# EAGLE design modulesShield_v1_1 (EAGLE 6.5.0)
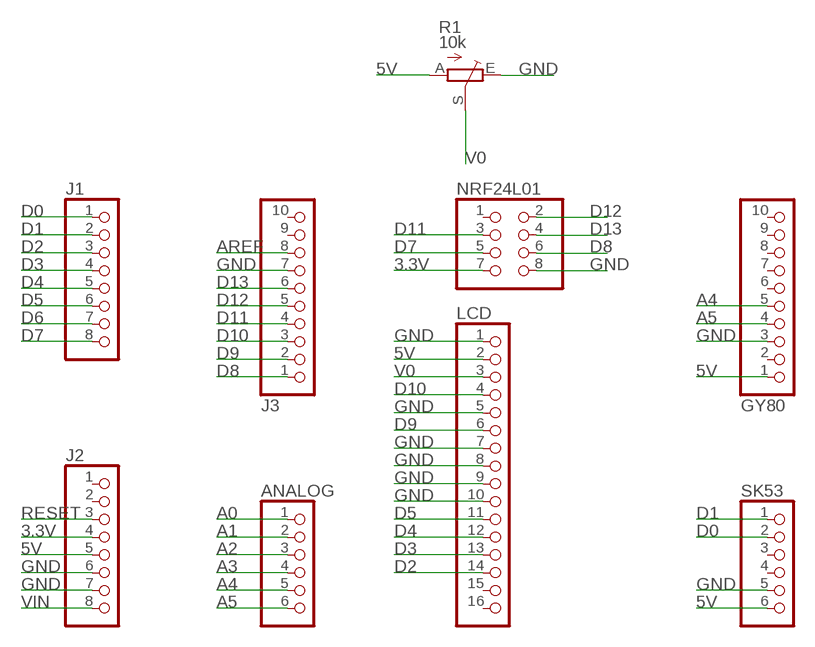
[diagram p0: schematic, sheet 1]

## Parts
ANALOG  PINHD-1X6  [1X06]
GY80  PINHD-1X10TH  [1X10-TH]
J1  PINHD-1X8TH  [1X08-TH]
J2  PINHD-1X8TH  [1X08-TH]
J3  PINHD-1X10TH  [1X10-TH]
LCD  PINHD-1X16  [1X16]
NRF24L01  PINHD-2X4  [2X04]
R1  10k  TRIM_EU-CA6V  [CA6V]
SK53  PINHD-1X6  [1X06]

## Nets
3.3V: J2.4 NRF24L01.7
5V: GY80.1 J2.5 LCD.2 R1.A SK53.6
A0: ANALOG.1
A1: ANALOG.2
A2: ANALOG.3
A3: ANALOG.4
A4: ANALOG.5 GY80.5
A5: ANALOG.6 GY80.4
AREF: J3.8
D0: J1.1 SK53.2
D1: J1.2 SK53.1
D2: J1.3 LCD.14
D3: J1.4 LCD.13
D4: J1.5 LCD.12
D5: J1.6 LCD.11
D6: J1.7
D7: J1.8 NRF24L01.5
D8: J3.1 NRF24L01.6
D9: J3.2 LCD.6
D10: J3.3 LCD.4
D11: J3.4 NRF24L01.3
D12: J3.5 NRF24L01.2
D13: J3.6 NRF24L01.4
GND: GY80.3 J2.6 J2.7 J3.7 LCD.1 LCD.5 LCD.7 LCD.8 LCD.9 LCD.10 NRF24L01.8 R1.E SK53.5
RESET: J2.3
V0: LCD.3 R1.S
VIN: J2.8
Unconnected: GY80.2 GY80.6 GY80.7 GY80.8 GY80.9 GY80.10 J2.1 J2.2 J3.9 J3.10 LCD.15 LCD.16 NRF24L01.1 SK53.3 SK53.4

## Library data of the parts
ANALOG SK53 = pinhead:PINHD-1X6: PIN HEADER
GY80 J3 = SmartPrj:PINHD-1X10: PIN HEADER
J1 J2 = SmartPrj:PINHD-1X8: PIN HEADER
LCD = pinhead:PINHD-1X16: PIN HEADER
NRF24L01 = pinhead:PINHD-2X4: PIN HEADER
R1 = pot:TRIM_EU-: POTENTIOMETER

## Net classes
0 default: width 0.203 mm

## Board
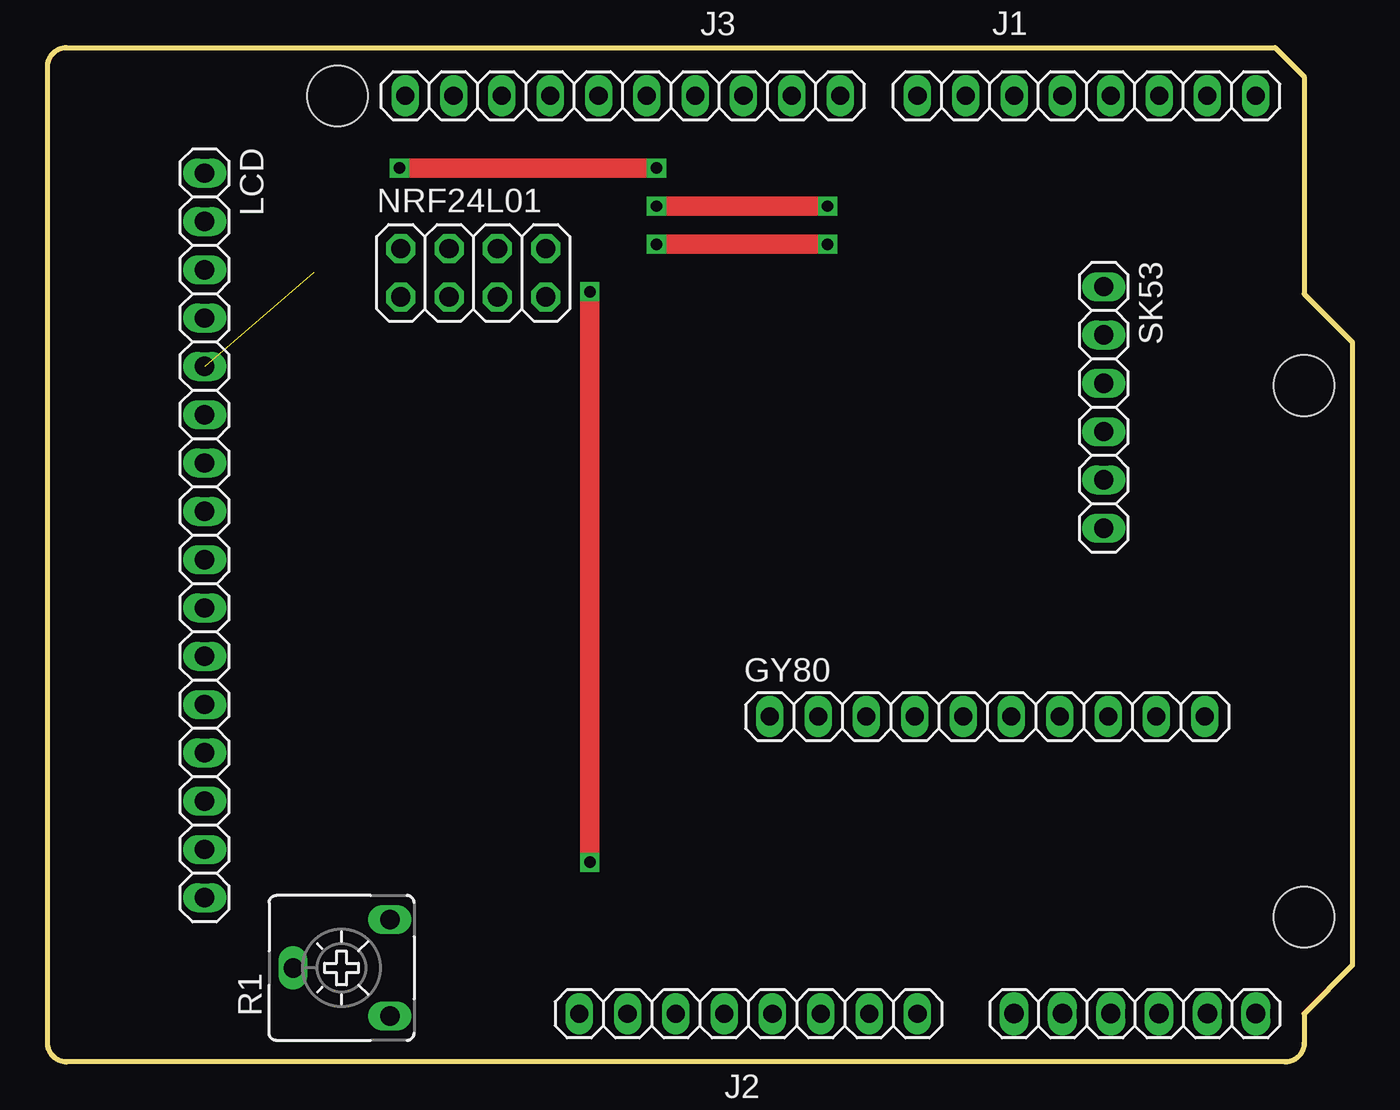
[diagram p1: board, top side]
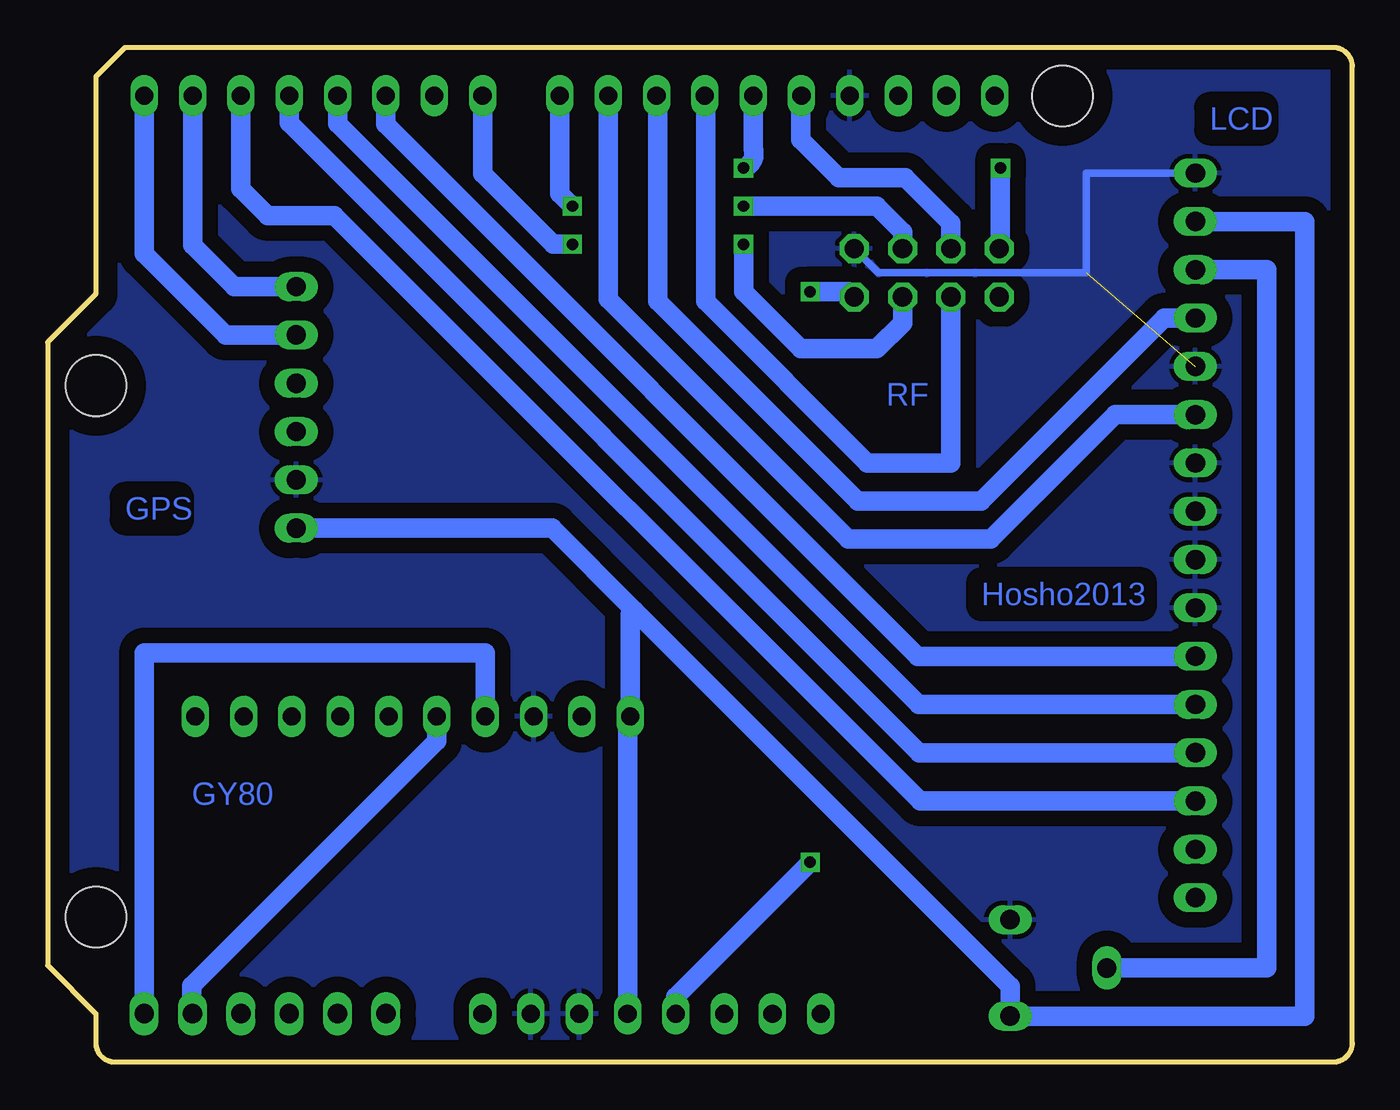
[diagram p2: board, bottom side, seen from below]

Size 68.58 x 53.34 mm. Coordinates in mm from the lower left corner, seen from the top.
Outline: 64.52,53.34 66.04,51.82 66.04,40.39 68.58,37.85 68.58,5.08 66.04,2.54 66.04,1 arc-90 65.04,0 1,0 arc-90 0,1 0,52.34 arc-90 1,53.34 64.52,53.34
Copper layers (1*16): Top 0.035mm / dielectric 1.5mm / Bottom 0.035mm
Design rules "default": minimum track width 10mil, minimum drill 24mil, track to track 8mil, track to pad 8mil, pad to pad 8mil, via to via 8mil, smd to smd 8mil, copper to edge 40mil, drill to drill 8mil, minimum pad ring 10mil, minimum via ring 8mil, stop-mask expansion 2mil, vias tented up to drill 0mil, thermal gap 10mil
Holes 3.2 mm at 15.24,50.8 66.04,7.62 66.04,35.56

### Footprints (pad centres in the part's own frame; a part is rotated, then mirrored left to right if it is on the bottom)
1X06 = drill 1.016 long: 1 -6.35,0; 2 -3.81,0; 3 -1.27,0; 4 1.27,0; 5 3.81,0; 6 6.35,0
1X10-TH = drill 0.95 pad 1.422 long: 1 -11.43,0; 2 -8.89,0; 3 -6.35,0; 4 -3.81,0; 5 -1.27,0; 6 1.27,0; 7 3.81,0; 8 6.35,0; 9 8.89,0; 10 11.43,0
1X08-TH = drill 0.95 pad 1.422 long: 1 -8.89,0; 2 -6.35,0; 3 -3.81,0; 4 -1.27,0; 5 1.27,0; 6 3.81,0; 7 6.35,0; 8 8.89,0
1X16 = drill 1.016 long: 1 -19.05,0; 2 -16.51,0; 3 -13.97,0; 4 -11.43,0; 5 -8.89,0; 6 -6.35,0; 7 -3.81,0; 8 -1.27,0; 9 1.27,0; 10 3.81,0; 11 6.35,0; 12 8.89,0; 13 11.43,0; 14 13.97,0; 15 16.51,0; 16 19.05,0
2X04 = drill 1.016 octagon: 1 -3.81,-1.27; 2 -3.81,1.27; 3 -1.27,-1.27; 4 -1.27,1.27; 5 1.27,-1.27; 6 1.27,1.27; 7 3.81,-1.27; 8 3.81,1.27
CA6V = drill 1.016 long: A -2.54,-2.54; E 2.54,-2.54; S 0,2.54

### Placement (x,y rotation side)
ANALOG  57.15,2.54 0 top
GY80  49.39,18.16 0 top
J1  54.61,50.8 180 top
J2  36.83,2.54 0 top
J3  30.23,50.8 180 top
LCD  8.26,27.69 270 top
NRF24L01  22.38,41.5 0 top
R1  15.45,4.95 90 top
SK53  55.51,34.42 270 top

### Tracks (layer width: path | path; a pad name or v marks a point on that pad's centre or on a via)
3.3V  (via drill 0.6)
  Top 1.016: v28.5,40.5 v28.5,10.5
  Bottom 1.016: NRF24L01.7 26.46,40.5 v28.5,40.5 | v28.5,10.5 35.56,3.44 J2.4
5V
  Bottom 1.016: SK53.6 42.07,28.07 37.75,23.75 | LCD.2 2.5,44.2 2.5,2.41 R1.A 17.99,3.99 37.75,23.75 | J2.5 38.1,18.02 arc90 GY80.1 37.96,23.54 37.75,23.75
A4
  Bottom 1.016: GY80.5 48.12,16.88 61,4 61,2.58 ANALOG.5
A5
  Bottom 1.016: GY80.4 45.58,21.5 63.5,21.5 ANALOG.6
D0
  Bottom 1.016: J1.1 63.5,42.5 59.23,38.23 SK53.2
D1
  Bottom 1.016: J1.2 60.96,42.96 58.77,40.77 SK53.1
D2
  Bottom 1.016: J1.3 58.42,45.92 57,44.5 53.5,44.5 22.72,13.72 LCD.14
D3
  Bottom 1.016: J1.4 55.88,49.38 22.76,16.26 LCD.13
D4
  Bottom 1.016: J1.5 53.34,49.34 22.8,18.8 LCD.12
D5
  Bottom 1.016: J1.6 50.8,49.3 22.84,21.34 LCD.11
D7  (via drill 0.6)
  Top 1.016: v32,43 v41,43
  Bottom 1.016: NRF24L01.5 23.65,38.85 25,37.5 29,37.5 32,40.5 v32,43 | v41,43 42,43 45.72,46.72 J1.8
D8  (via drill 0.6)
  Top 1.016: v32,45 v41,45
  Bottom 1.016: NRF24L01.6 23.65,43.65 25,45 v32,45 | v41,45 41.66,45.66 J3.1
D9
  Bottom 1.016: LCD.6 12.46,34.04 19,27.5 26.5,27.5 39.12,40.12 J3.2
D10
  Bottom 1.016: LCD.4 9.88,39.12 19.5,29.5 26,29.5 36.5,40 36.5,50.72 J3.3
D11
  Bottom 1.016: NRF24L01.3 21.11,31.5 25.5,31.5 34,40 34,50.76 J3.4
D12  (via drill 0.6)
  Top 1.016: v18.5,47 v32,47
  Bottom 1.016: NRF24L01.2 18.5,42.83 v18.5,47 | v32,47 arc-90 31.5,48 J3.5
D13
  Bottom 1.016: NRF24L01.4 21.11,44.11 23.5,46.5 27,46.5 29,48.5 29,50.76 J3.6
GND  (1 unrouted)
  Bottom 0.406: NRF24L01.8 24.92,41.5 14,41.5 14,46.74 LCD.1
  pour Bottom (isolate 0.813): -0.5,53.5 69,53.5 69,-0.5 -0.5,-0.5
V0
  Bottom 1.016: LCD.3 4.5,41.66 4.5,4.95 R1.S

### Text on the board
Bottom: LCD | RF | GPS | Hosho2013 | GY80
Reference: USB | ETH